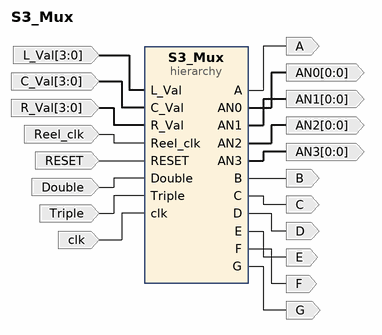
[diagram p0: block diagram of the top level]
# Vivado block design S3_Mux, xc7a35tcpg236-1, Vivado 2018.3
create_bd_design S3_Mux

create_bd_port -dir I -from 3 -to 0 L_Val
create_bd_port -dir I -from 3 -to 0 C_Val
create_bd_port -dir I -from 3 -to 0 R_Val
create_bd_port -dir I Triple
create_bd_port -dir I Double
create_bd_port -dir I Reel_clk
create_bd_port -dir O -from 0 -to 0 AN0
create_bd_port -dir O -from 0 -to 0 AN1
create_bd_port -dir O -from 0 -to 0 AN2
create_bd_port -dir O -from 0 -to 0 AN3
create_bd_port -dir O A
create_bd_port -dir O B
create_bd_port -dir O C
create_bd_port -dir O D
create_bd_port -dir O E
create_bd_port -dir O F
create_bd_port -dir O G
create_bd_port -dir I RESET
create_bd_port -dir I clk

create_bd_cell -type hier S3_Mux

# ---- hierarchy /S3_Mux ----
current_bd_instance /S3_Mux
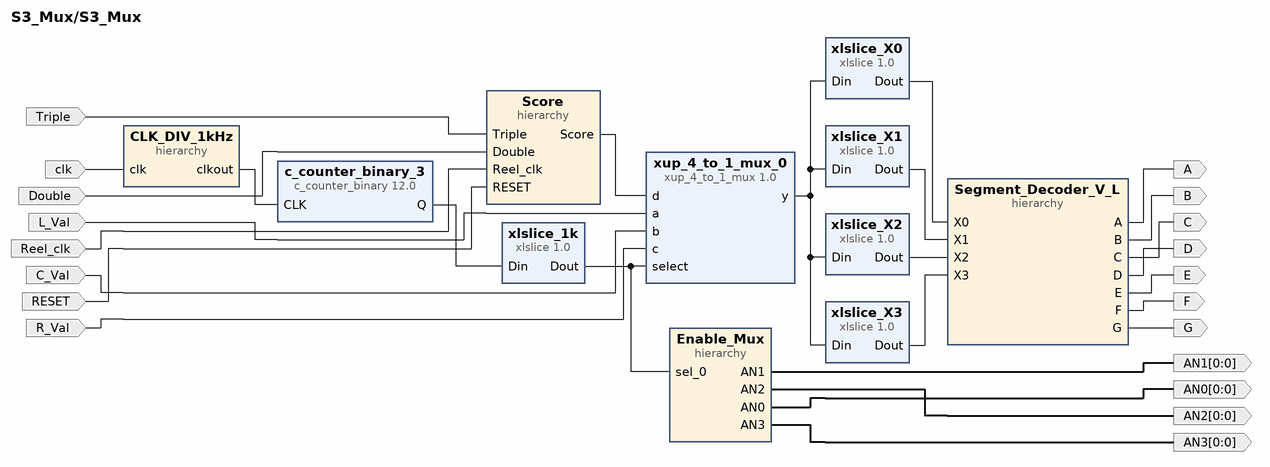
[diagram p1: block diagram inside /S3_Mux]
create_bd_pin -dir I L_Val
create_bd_pin -dir I C_Val
create_bd_pin -dir I R_Val
create_bd_pin -dir I Triple
create_bd_pin -dir I Double
create_bd_pin -dir I Reel_clk
create_bd_pin -dir I RESET
create_bd_pin -dir O -from 0 -to 0 AN1
create_bd_pin -dir O -from 0 -to 0 AN2
create_bd_pin -dir O -from 0 -to 0 AN3
create_bd_pin -dir O -from 0 -to 0 AN0
create_bd_pin -dir I clk
create_bd_pin -dir O G
create_bd_pin -dir O B
create_bd_pin -dir O A
create_bd_pin -dir O D
create_bd_pin -dir O F
create_bd_pin -dir O E
create_bd_pin -dir O C

create_bd_cell -type ip -vlnv xilinx.com:xup:xup_4_to_1_mux:1.0 xup_4_to_1_mux_0
create_bd_cell -type ip -vlnv xilinx.com:ip:xlslice:1.0 xlslice_X0
set_property -dict {CONFIG.DIN_FROM 0 CONFIG.DIN_TO 0 CONFIG.DIN_WIDTH 4} [get_bd_cells xlslice_X0]
create_bd_cell -type ip -vlnv xilinx.com:ip:xlslice:1.0 xlslice_X1
set_property -dict {CONFIG.DIN_FROM 0 CONFIG.DIN_TO 0 CONFIG.DIN_WIDTH 4} [get_bd_cells xlslice_X1]
create_bd_cell -type ip -vlnv xilinx.com:ip:xlslice:1.0 xlslice_1k
set_property -dict {CONFIG.DIN_FROM 1 CONFIG.DIN_TO 0 CONFIG.DIN_WIDTH 3 CONFIG.DOUT_WIDTH 2} [get_bd_cells xlslice_1k]
create_bd_cell -type ip -vlnv xilinx.com:ip:xlslice:1.0 xlslice_X2
set_property -dict {CONFIG.DIN_FROM 0 CONFIG.DIN_TO 0 CONFIG.DIN_WIDTH 4} [get_bd_cells xlslice_X2]
create_bd_cell -type ip -vlnv xilinx.com:ip:c_counter_binary:12.0 c_counter_binary_3
set_property -dict {CONFIG.Final_Count_Value 3 CONFIG.Output_Width 3 CONFIG.Restrict_Count true} [get_bd_cells c_counter_binary_3]
create_bd_cell -type ip -vlnv xilinx.com:ip:xlslice:1.0 xlslice_X3
set_property -dict {CONFIG.DIN_FROM 0 CONFIG.DIN_TO 0 CONFIG.DIN_WIDTH 4} [get_bd_cells xlslice_X3]
create_bd_cell -type hier Score
create_bd_cell -type hier Enable_Mux
create_bd_cell -type hier CLK_DIV_1kHz
create_bd_cell -type hier Segment_Decoder_V_L

# ---- hierarchy /S3_Mux/Score ----
current_bd_instance /S3_Mux/Score
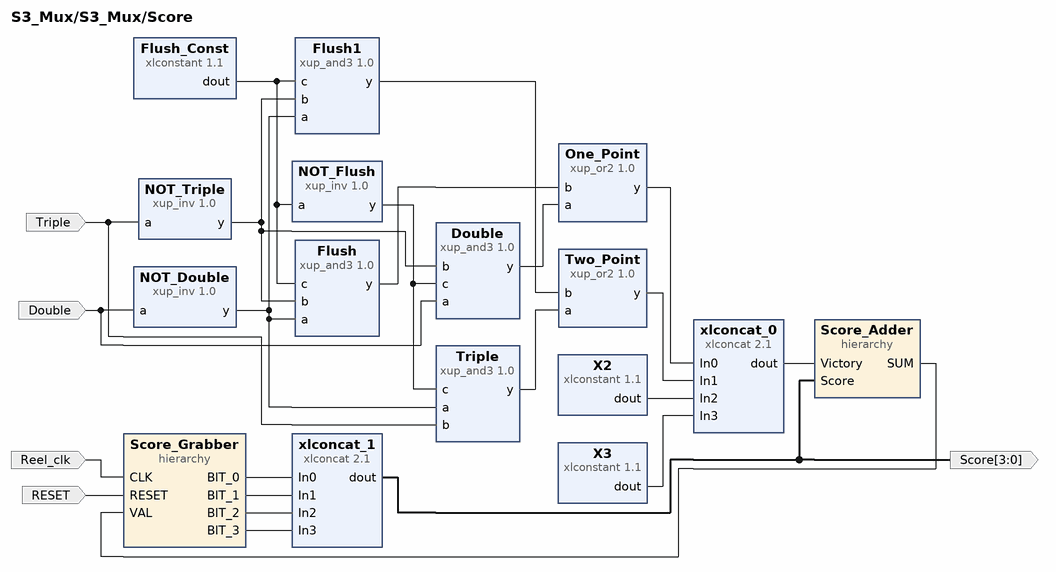
[diagram p2: block diagram inside /S3_Mux/Score]
create_bd_pin -dir I Triple
create_bd_pin -dir I Double
create_bd_pin -dir O -from 3 -to 0 Score
create_bd_pin -dir I Reel_clk
create_bd_pin -dir I RESET

create_bd_cell -type ip -vlnv xilinx.com:xup:xup_inv:1.0 NOT_Triple
set_property -dict {CONFIG.DELAY 0} [get_bd_cells NOT_Triple]
create_bd_cell -type ip -vlnv xilinx.com:xup:xup_or2:1.0 Two_Point
set_property -dict {CONFIG.DELAY 0} [get_bd_cells Two_Point]
create_bd_cell -type ip -vlnv xilinx.com:ip:xlconstant:1.1 Flush_Const
set_property -dict {CONFIG.CONST_VAL 0} [get_bd_cells Flush_Const]
create_bd_cell -type ip -vlnv xilinx.com:xup:xup_inv:1.0 NOT_Double
set_property -dict {CONFIG.DELAY 0} [get_bd_cells NOT_Double]
create_bd_cell -type ip -vlnv xilinx.com:ip:xlconcat:2.1 xlconcat_0
set_property -dict {CONFIG.NUM_PORTS 4} [get_bd_cells xlconcat_0]
create_bd_cell -type ip -vlnv xilinx.com:ip:xlconcat:2.1 xlconcat_1
set_property -dict {CONFIG.NUM_PORTS 4} [get_bd_cells xlconcat_1]
create_bd_cell -type ip -vlnv xilinx.com:xup:xup_and3:1.0 Flush
create_bd_cell -type ip -vlnv xilinx.com:xup:xup_and3:1.0 Double
create_bd_cell -type ip -vlnv xilinx.com:xup:xup_inv:1.0 NOT_Flush
set_property -dict {CONFIG.DELAY 0} [get_bd_cells NOT_Flush]
create_bd_cell -type ip -vlnv xilinx.com:xup:xup_and3:1.0 Triple
create_bd_cell -type ip -vlnv xilinx.com:xup:xup_and3:1.0 Flush1
create_bd_cell -type ip -vlnv xilinx.com:ip:xlconstant:1.1 X2
set_property -dict {CONFIG.CONST_VAL 0} [get_bd_cells X2]
create_bd_cell -type ip -vlnv xilinx.com:ip:xlconstant:1.1 X3
set_property -dict {CONFIG.CONST_VAL 0} [get_bd_cells X3]
create_bd_cell -type ip -vlnv xilinx.com:xup:xup_or2:1.0 One_Point
set_property -dict {CONFIG.DELAY 0} [get_bd_cells One_Point]
create_bd_cell -type hier Score_Adder
create_bd_cell -type hier Score_Grabber

# ---- hierarchy /S3_Mux/Score/Score_Adder ----
current_bd_instance /S3_Mux/Score/Score_Adder
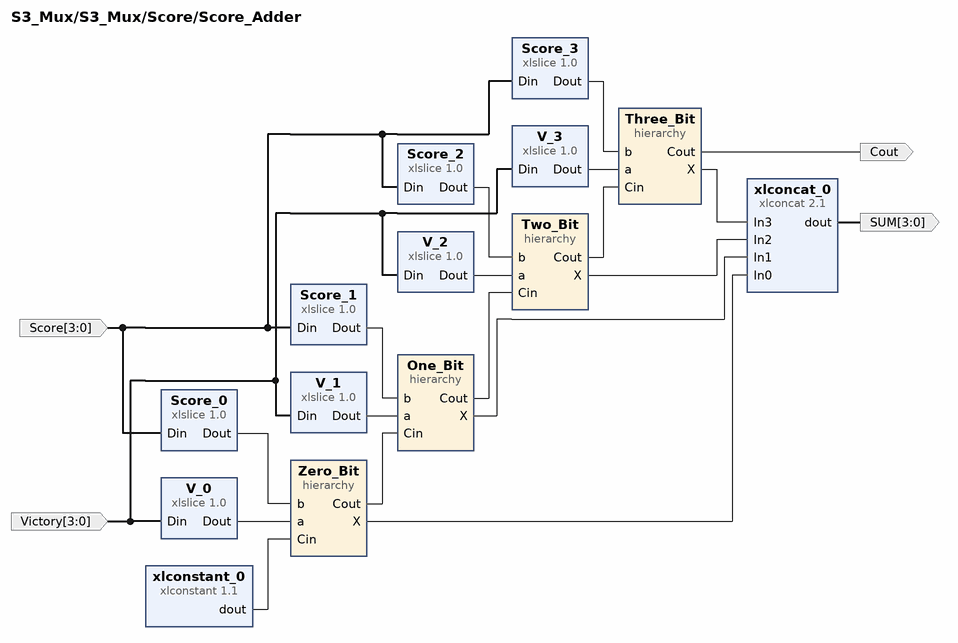
[diagram p3: block diagram inside /S3_Mux/Score/Score_Adder]
create_bd_pin -dir I -from 3 -to 0 Score
create_bd_pin -dir O -from 3 -to 0 SUM
create_bd_pin -dir I -from 3 -to 0 Victory
create_bd_pin -dir O Cout

create_bd_cell -type ip -vlnv xilinx.com:ip:xlslice:1.0 Score_0
set_property -dict {CONFIG.DIN_FROM 0 CONFIG.DIN_TO 0 CONFIG.DIN_WIDTH 4} [get_bd_cells Score_0]
create_bd_cell -type ip -vlnv xilinx.com:ip:xlslice:1.0 Score_1
set_property -dict {CONFIG.DIN_FROM 1 CONFIG.DIN_TO 1 CONFIG.DIN_WIDTH 4 CONFIG.DOUT_WIDTH 1} [get_bd_cells Score_1]
create_bd_cell -type ip -vlnv xilinx.com:ip:xlconcat:2.1 xlconcat_0
set_property -dict {CONFIG.NUM_PORTS 4} [get_bd_cells xlconcat_0]
create_bd_cell -type ip -vlnv xilinx.com:ip:xlslice:1.0 Score_2
set_property -dict {CONFIG.DIN_FROM 2 CONFIG.DIN_TO 2 CONFIG.DIN_WIDTH 4 CONFIG.DOUT_WIDTH 1} [get_bd_cells Score_2]
create_bd_cell -type ip -vlnv xilinx.com:ip:xlconstant:1.1 xlconstant_0
set_property -dict {CONFIG.CONST_VAL 0} [get_bd_cells xlconstant_0]
create_bd_cell -type ip -vlnv xilinx.com:ip:xlslice:1.0 Score_3
set_property -dict {CONFIG.DIN_FROM 3 CONFIG.DIN_TO 3 CONFIG.DIN_WIDTH 4 CONFIG.DOUT_WIDTH 1} [get_bd_cells Score_3]
create_bd_cell -type ip -vlnv xilinx.com:ip:xlslice:1.0 V_0
set_property -dict {CONFIG.DIN_FROM 0 CONFIG.DIN_TO 0 CONFIG.DIN_WIDTH 4} [get_bd_cells V_0]
create_bd_cell -type ip -vlnv xilinx.com:ip:xlslice:1.0 V_1
set_property -dict {CONFIG.DIN_FROM 1 CONFIG.DIN_TO 1 CONFIG.DIN_WIDTH 4 CONFIG.DOUT_WIDTH 1} [get_bd_cells V_1]
create_bd_cell -type ip -vlnv xilinx.com:ip:xlslice:1.0 V_2
set_property -dict {CONFIG.DIN_FROM 2 CONFIG.DIN_TO 2 CONFIG.DIN_WIDTH 4 CONFIG.DOUT_WIDTH 1} [get_bd_cells V_2]
create_bd_cell -type ip -vlnv xilinx.com:ip:xlslice:1.0 V_3
set_property -dict {CONFIG.DIN_FROM 3 CONFIG.DIN_TO 3 CONFIG.DIN_WIDTH 4 CONFIG.DOUT_WIDTH 1} [get_bd_cells V_3]
create_bd_cell -type hier One_Bit
create_bd_cell -type hier Three_Bit
create_bd_cell -type hier Zero_Bit
create_bd_cell -type hier Two_Bit

# ---- hierarchy /S3_Mux/Score/Score_Adder/One_Bit ----
current_bd_instance /S3_Mux/Score/Score_Adder/One_Bit
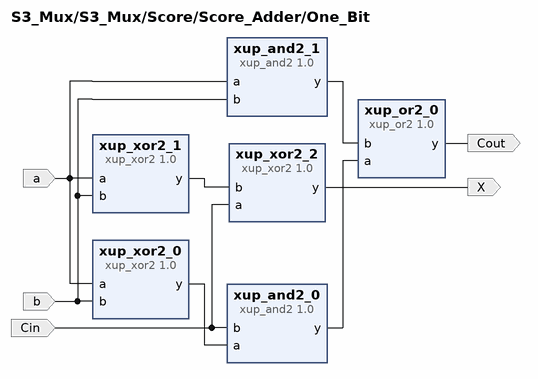
[diagram p4: block diagram inside /S3_Mux/Score/Score_Adder/One_Bit]
create_bd_pin -dir I a
create_bd_pin -dir I b
create_bd_pin -dir I Cin
create_bd_pin -dir O X
create_bd_pin -dir O Cout

create_bd_cell -type ip -vlnv xilinx.com:xup:xup_xor2:1.0 xup_xor2_0
set_property -dict {CONFIG.DELAY 0} [get_bd_cells xup_xor2_0]
create_bd_cell -type ip -vlnv xilinx.com:xup:xup_xor2:1.0 xup_xor2_1
set_property -dict {CONFIG.DELAY 0} [get_bd_cells xup_xor2_1]
create_bd_cell -type ip -vlnv xilinx.com:xup:xup_xor2:1.0 xup_xor2_2
set_property -dict {CONFIG.DELAY 0} [get_bd_cells xup_xor2_2]
create_bd_cell -type ip -vlnv xilinx.com:xup:xup_and2:1.0 xup_and2_0
create_bd_cell -type ip -vlnv xilinx.com:xup:xup_and2:1.0 xup_and2_1
create_bd_cell -type ip -vlnv xilinx.com:xup:xup_or2:1.0 xup_or2_0
set_property -dict {CONFIG.DELAY 0} [get_bd_cells xup_or2_0]

# ---- hierarchy /S3_Mux/Score/Score_Adder/Three_Bit ----
current_bd_instance /S3_Mux/Score/Score_Adder/Three_Bit
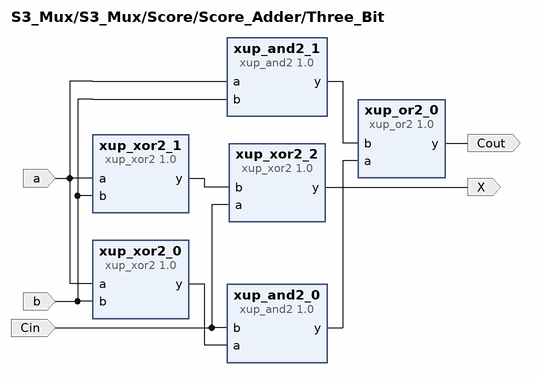
[diagram p5: block diagram inside /S3_Mux/Score/Score_Adder/Three_Bit]
create_bd_pin -dir I a
create_bd_pin -dir I b
create_bd_pin -dir I Cin
create_bd_pin -dir O X
create_bd_pin -dir O Cout

create_bd_cell -type ip -vlnv xilinx.com:xup:xup_xor2:1.0 xup_xor2_0
set_property -dict {CONFIG.DELAY 0} [get_bd_cells xup_xor2_0]
create_bd_cell -type ip -vlnv xilinx.com:xup:xup_xor2:1.0 xup_xor2_1
set_property -dict {CONFIG.DELAY 0} [get_bd_cells xup_xor2_1]
create_bd_cell -type ip -vlnv xilinx.com:xup:xup_xor2:1.0 xup_xor2_2
set_property -dict {CONFIG.DELAY 0} [get_bd_cells xup_xor2_2]
create_bd_cell -type ip -vlnv xilinx.com:xup:xup_and2:1.0 xup_and2_0
create_bd_cell -type ip -vlnv xilinx.com:xup:xup_and2:1.0 xup_and2_1
create_bd_cell -type ip -vlnv xilinx.com:xup:xup_or2:1.0 xup_or2_0
set_property -dict {CONFIG.DELAY 0} [get_bd_cells xup_or2_0]

# ---- hierarchy /S3_Mux/Score/Score_Adder/Zero_Bit ----
current_bd_instance /S3_Mux/Score/Score_Adder/Zero_Bit
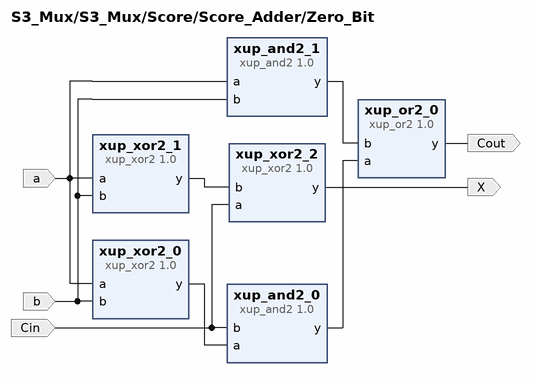
[diagram p6: block diagram inside /S3_Mux/Score/Score_Adder/Zero_Bit]
create_bd_pin -dir I a
create_bd_pin -dir I b
create_bd_pin -dir I Cin
create_bd_pin -dir O X
create_bd_pin -dir O Cout

create_bd_cell -type ip -vlnv xilinx.com:xup:xup_xor2:1.0 xup_xor2_0
set_property -dict {CONFIG.DELAY 0} [get_bd_cells xup_xor2_0]
create_bd_cell -type ip -vlnv xilinx.com:xup:xup_xor2:1.0 xup_xor2_1
set_property -dict {CONFIG.DELAY 0} [get_bd_cells xup_xor2_1]
create_bd_cell -type ip -vlnv xilinx.com:xup:xup_xor2:1.0 xup_xor2_2
set_property -dict {CONFIG.DELAY 0} [get_bd_cells xup_xor2_2]
create_bd_cell -type ip -vlnv xilinx.com:xup:xup_and2:1.0 xup_and2_0
create_bd_cell -type ip -vlnv xilinx.com:xup:xup_and2:1.0 xup_and2_1
create_bd_cell -type ip -vlnv xilinx.com:xup:xup_or2:1.0 xup_or2_0
set_property -dict {CONFIG.DELAY 0} [get_bd_cells xup_or2_0]

# ---- hierarchy /S3_Mux/Score/Score_Adder/Two_Bit ----
current_bd_instance /S3_Mux/Score/Score_Adder/Two_Bit
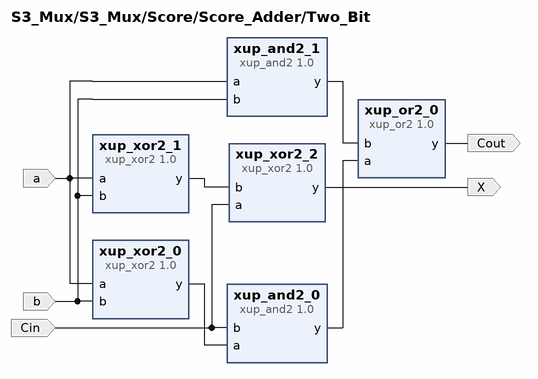
[diagram p7: block diagram inside /S3_Mux/Score/Score_Adder/Two_Bit]
create_bd_pin -dir I a
create_bd_pin -dir I b
create_bd_pin -dir I Cin
create_bd_pin -dir O X
create_bd_pin -dir O Cout

create_bd_cell -type ip -vlnv xilinx.com:xup:xup_xor2:1.0 xup_xor2_0
set_property -dict {CONFIG.DELAY 0} [get_bd_cells xup_xor2_0]
create_bd_cell -type ip -vlnv xilinx.com:xup:xup_xor2:1.0 xup_xor2_1
set_property -dict {CONFIG.DELAY 0} [get_bd_cells xup_xor2_1]
create_bd_cell -type ip -vlnv xilinx.com:xup:xup_xor2:1.0 xup_xor2_2
set_property -dict {CONFIG.DELAY 0} [get_bd_cells xup_xor2_2]
create_bd_cell -type ip -vlnv xilinx.com:xup:xup_and2:1.0 xup_and2_0
create_bd_cell -type ip -vlnv xilinx.com:xup:xup_and2:1.0 xup_and2_1
create_bd_cell -type ip -vlnv xilinx.com:xup:xup_or2:1.0 xup_or2_0
set_property -dict {CONFIG.DELAY 0} [get_bd_cells xup_or2_0]

# ---- hierarchy /S3_Mux/Score/Score_Grabber ----
current_bd_instance /S3_Mux/Score/Score_Grabber
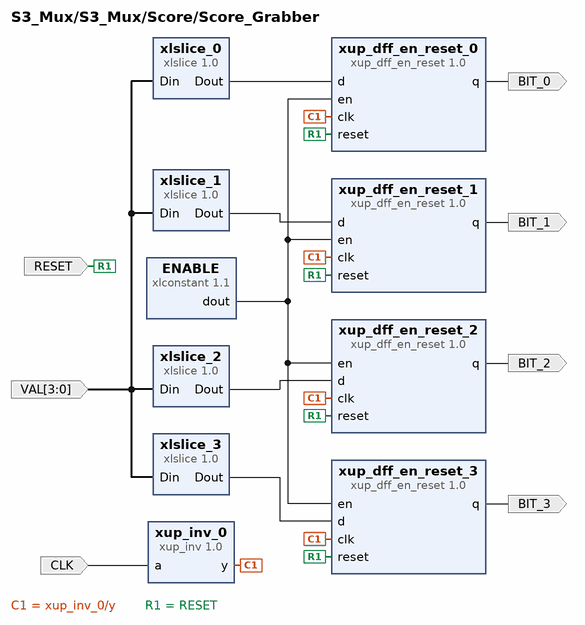
[diagram p8: block diagram inside /S3_Mux/Score/Score_Grabber]
create_bd_pin -dir I CLK
create_bd_pin -dir I RESET
create_bd_pin -dir O BIT_0
create_bd_pin -dir I -from 3 -to 0 VAL
create_bd_pin -dir O BIT_1
create_bd_pin -dir O BIT_2
create_bd_pin -dir O BIT_3

create_bd_cell -type ip -vlnv xilinx.com:xup:xup_dff_en_reset:1.0 xup_dff_en_reset_0
set_property -dict {CONFIG.DELAY 0} [get_bd_cells xup_dff_en_reset_0]
create_bd_cell -type ip -vlnv xilinx.com:ip:xlslice:1.0 xlslice_0
set_property -dict {CONFIG.DIN_FROM 0 CONFIG.DIN_TO 0 CONFIG.DIN_WIDTH 4} [get_bd_cells xlslice_0]
create_bd_cell -type ip -vlnv xilinx.com:xup:xup_dff_en_reset:1.0 xup_dff_en_reset_1
set_property -dict {CONFIG.DELAY 0} [get_bd_cells xup_dff_en_reset_1]
create_bd_cell -type ip -vlnv xilinx.com:ip:xlslice:1.0 xlslice_1
set_property -dict {CONFIG.DIN_FROM 1 CONFIG.DIN_TO 1 CONFIG.DIN_WIDTH 4 CONFIG.DOUT_WIDTH 1} [get_bd_cells xlslice_1]
create_bd_cell -type ip -vlnv xilinx.com:xup:xup_dff_en_reset:1.0 xup_dff_en_reset_2
set_property -dict {CONFIG.DELAY 0} [get_bd_cells xup_dff_en_reset_2]
create_bd_cell -type ip -vlnv xilinx.com:ip:xlslice:1.0 xlslice_2
set_property -dict {CONFIG.DIN_FROM 2 CONFIG.DIN_TO 2 CONFIG.DIN_WIDTH 4 CONFIG.DOUT_WIDTH 1} [get_bd_cells xlslice_2]
create_bd_cell -type ip -vlnv xilinx.com:xup:xup_dff_en_reset:1.0 xup_dff_en_reset_3
set_property -dict {CONFIG.DELAY 0} [get_bd_cells xup_dff_en_reset_3]
create_bd_cell -type ip -vlnv xilinx.com:ip:xlslice:1.0 xlslice_3
set_property -dict {CONFIG.DIN_FROM 3 CONFIG.DIN_TO 3 CONFIG.DIN_WIDTH 4 CONFIG.DOUT_WIDTH 1} [get_bd_cells xlslice_3]
create_bd_cell -type ip -vlnv xilinx.com:xup:xup_inv:1.0 xup_inv_0
set_property -dict {CONFIG.DELAY 0} [get_bd_cells xup_inv_0]
create_bd_cell -type ip -vlnv xilinx.com:ip:xlconstant:1.1 ENABLE
set_property -dict {CONFIG.CONST_VAL 0} [get_bd_cells ENABLE]

# ---- hierarchy /S3_Mux/Enable_Mux ----
current_bd_instance /S3_Mux/Enable_Mux
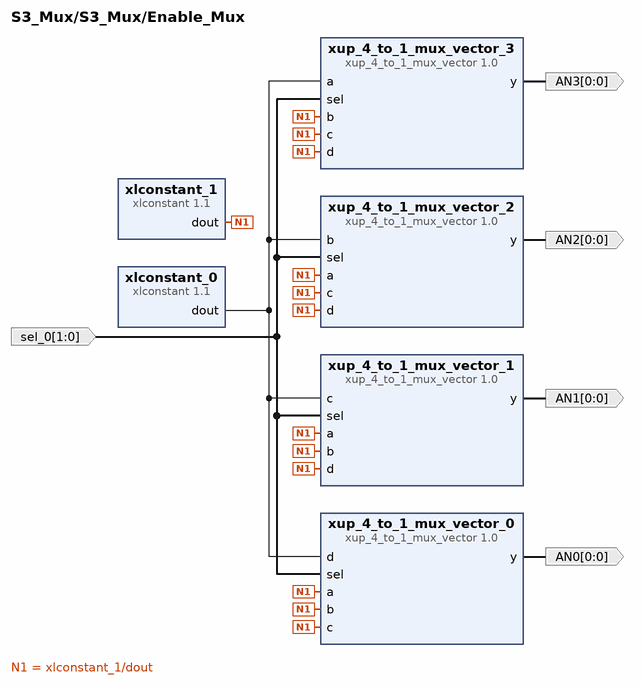
[diagram p9: block diagram inside /S3_Mux/Enable_Mux]
create_bd_pin -dir I -from 1 -to 0 sel_0
create_bd_pin -dir O -from 0 -to 0 AN1
create_bd_pin -dir O -from 0 -to 0 AN2
create_bd_pin -dir O -from 0 -to 0 AN3
create_bd_pin -dir O -from 0 -to 0 AN0

create_bd_cell -type ip -vlnv xilinx.com:xup:xup_4_to_1_mux_vector:1.0 xup_4_to_1_mux_vector_1
set_property -dict {CONFIG.DELAY 0 CONFIG.SIZE 1} [get_bd_cells xup_4_to_1_mux_vector_1]
create_bd_cell -type ip -vlnv xilinx.com:xup:xup_4_to_1_mux_vector:1.0 xup_4_to_1_mux_vector_2
set_property -dict {CONFIG.DELAY 0 CONFIG.SIZE 1} [get_bd_cells xup_4_to_1_mux_vector_2]
create_bd_cell -type ip -vlnv xilinx.com:xup:xup_4_to_1_mux_vector:1.0 xup_4_to_1_mux_vector_3
set_property -dict {CONFIG.DELAY 0 CONFIG.SIZE 1} [get_bd_cells xup_4_to_1_mux_vector_3]
create_bd_cell -type ip -vlnv xilinx.com:ip:xlconstant:1.1 xlconstant_0
set_property -dict {CONFIG.CONST_VAL 0} [get_bd_cells xlconstant_0]
create_bd_cell -type ip -vlnv xilinx.com:ip:xlconstant:1.1 xlconstant_1
create_bd_cell -type ip -vlnv xilinx.com:xup:xup_4_to_1_mux_vector:1.0 xup_4_to_1_mux_vector_0
set_property -dict {CONFIG.DELAY 0 CONFIG.SIZE 1} [get_bd_cells xup_4_to_1_mux_vector_0]

# ---- hierarchy /S3_Mux/CLK_DIV_1kHz ----
current_bd_instance /S3_Mux/CLK_DIV_1kHz
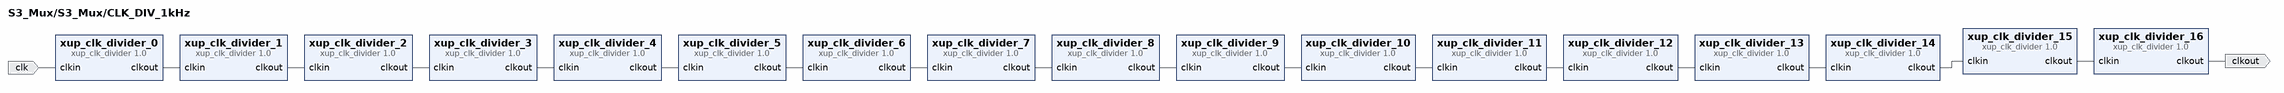
[diagram p10: block diagram inside /S3_Mux/CLK_DIV_1kHz]
create_bd_pin -dir O clkout
create_bd_pin -dir I clk

create_bd_cell -type ip -vlnv xilinx.com:xup:xup_clk_divider:1.0 xup_clk_divider_15
create_bd_cell -type ip -vlnv xilinx.com:xup:xup_clk_divider:1.0 xup_clk_divider_2
create_bd_cell -type ip -vlnv xilinx.com:xup:xup_clk_divider:1.0 xup_clk_divider_16
create_bd_cell -type ip -vlnv xilinx.com:xup:xup_clk_divider:1.0 xup_clk_divider_3
create_bd_cell -type ip -vlnv xilinx.com:xup:xup_clk_divider:1.0 xup_clk_divider_4
create_bd_cell -type ip -vlnv xilinx.com:xup:xup_clk_divider:1.0 xup_clk_divider_5
create_bd_cell -type ip -vlnv xilinx.com:xup:xup_clk_divider:1.0 xup_clk_divider_6
create_bd_cell -type ip -vlnv xilinx.com:xup:xup_clk_divider:1.0 xup_clk_divider_7
create_bd_cell -type ip -vlnv xilinx.com:xup:xup_clk_divider:1.0 xup_clk_divider_8
create_bd_cell -type ip -vlnv xilinx.com:xup:xup_clk_divider:1.0 xup_clk_divider_9
create_bd_cell -type ip -vlnv xilinx.com:xup:xup_clk_divider:1.0 xup_clk_divider_10
create_bd_cell -type ip -vlnv xilinx.com:xup:xup_clk_divider:1.0 xup_clk_divider_11
create_bd_cell -type ip -vlnv xilinx.com:xup:xup_clk_divider:1.0 xup_clk_divider_12
create_bd_cell -type ip -vlnv xilinx.com:xup:xup_clk_divider:1.0 xup_clk_divider_13
create_bd_cell -type ip -vlnv xilinx.com:xup:xup_clk_divider:1.0 xup_clk_divider_0
create_bd_cell -type ip -vlnv xilinx.com:xup:xup_clk_divider:1.0 xup_clk_divider_14
create_bd_cell -type ip -vlnv xilinx.com:xup:xup_clk_divider:1.0 xup_clk_divider_1

# ---- hierarchy /S3_Mux/Segment_Decoder_V_L ----
current_bd_instance /S3_Mux/Segment_Decoder_V_L
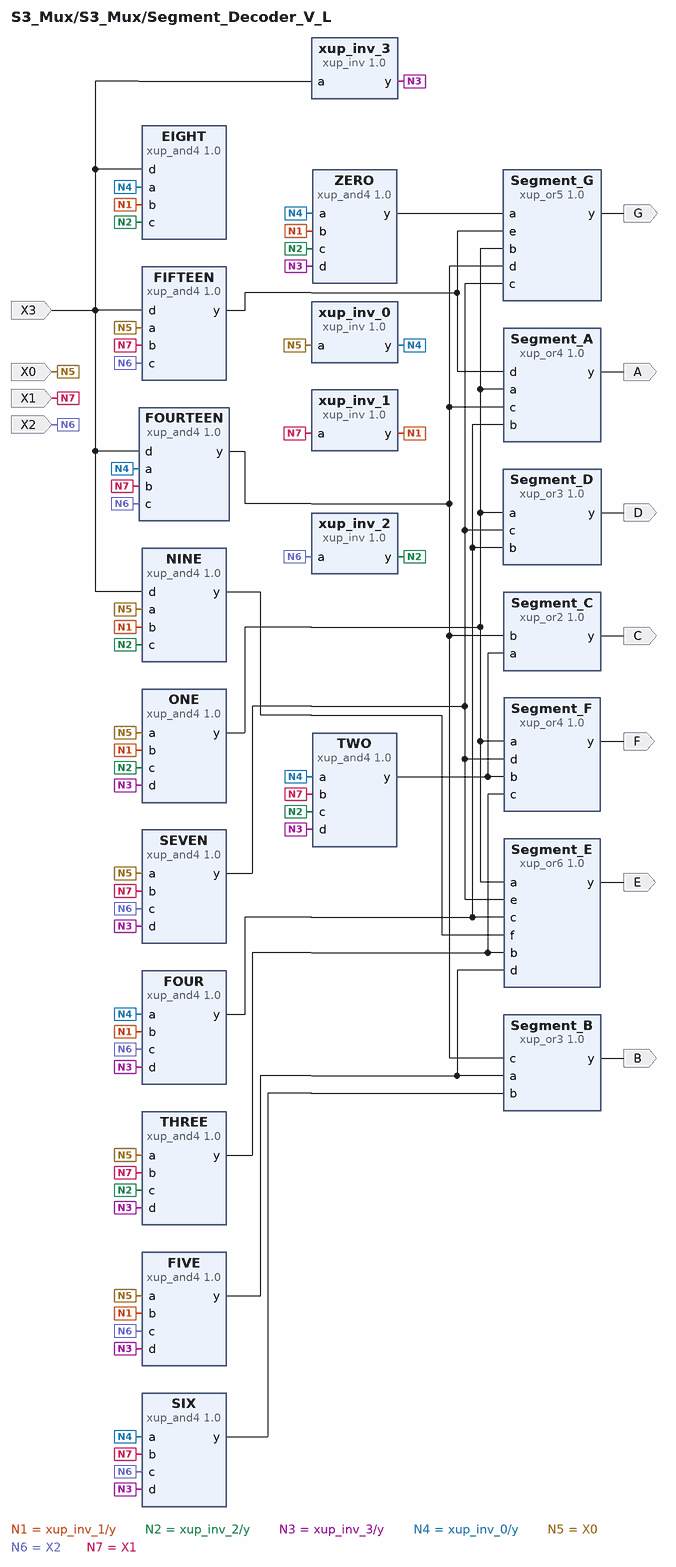
[diagram p11: block diagram inside /S3_Mux/Segment_Decoder_V_L]
create_bd_pin -dir I X0
create_bd_pin -dir O G
create_bd_pin -dir I X2
create_bd_pin -dir I X1
create_bd_pin -dir I X3
create_bd_pin -dir O B
create_bd_pin -dir O A
create_bd_pin -dir O D
create_bd_pin -dir O F
create_bd_pin -dir O E
create_bd_pin -dir O C

create_bd_cell -type ip -vlnv xilinx.com:xup:xup_and4:1.0 ONE
set_property -dict {CONFIG.DELAY 0} [get_bd_cells ONE]
create_bd_cell -type ip -vlnv xilinx.com:xup:xup_or5:1.0 Segment_G
set_property -dict {CONFIG.DELAY 0} [get_bd_cells Segment_G]
create_bd_cell -type ip -vlnv xilinx.com:xup:xup_and4:1.0 FOUR
set_property -dict {CONFIG.DELAY 0} [get_bd_cells FOUR]
create_bd_cell -type ip -vlnv xilinx.com:xup:xup_and4:1.0 FOURTEEN
set_property -dict {CONFIG.DELAY 0} [get_bd_cells FOURTEEN]
create_bd_cell -type ip -vlnv xilinx.com:xup:xup_and4:1.0 TWO
set_property -dict {CONFIG.DELAY 0} [get_bd_cells TWO]
create_bd_cell -type ip -vlnv xilinx.com:xup:xup_and4:1.0 FIVE
set_property -dict {CONFIG.DELAY 0} [get_bd_cells FIVE]
create_bd_cell -type ip -vlnv xilinx.com:xup:xup_or3:1.0 Segment_B
set_property -dict {CONFIG.DELAY 0} [get_bd_cells Segment_B]
create_bd_cell -type ip -vlnv xilinx.com:xup:xup_and4:1.0 SEVEN
set_property -dict {CONFIG.DELAY 0} [get_bd_cells SEVEN]
create_bd_cell -type ip -vlnv xilinx.com:xup:xup_or4:1.0 Segment_A
set_property -dict {CONFIG.DELAY 0} [get_bd_cells Segment_A]
create_bd_cell -type ip -vlnv xilinx.com:xup:xup_or3:1.0 Segment_D
set_property -dict {CONFIG.DELAY 0} [get_bd_cells Segment_D]
create_bd_cell -type ip -vlnv xilinx.com:xup:xup_and4:1.0 EIGHT
set_property -dict {CONFIG.DELAY 0} [get_bd_cells EIGHT]
create_bd_cell -type ip -vlnv xilinx.com:xup:xup_or4:1.0 Segment_F
set_property -dict {CONFIG.DELAY 0} [get_bd_cells Segment_F]
create_bd_cell -type ip -vlnv xilinx.com:xup:xup_or6:1.0 Segment_E
set_property -dict {CONFIG.DELAY 0} [get_bd_cells Segment_E]
create_bd_cell -type ip -vlnv xilinx.com:xup:xup_inv:1.0 xup_inv_0
set_property -dict {CONFIG.DELAY 0} [get_bd_cells xup_inv_0]
create_bd_cell -type ip -vlnv xilinx.com:xup:xup_and4:1.0 FIFTEEN
set_property -dict {CONFIG.DELAY 0} [get_bd_cells FIFTEEN]
create_bd_cell -type ip -vlnv xilinx.com:xup:xup_inv:1.0 xup_inv_1
set_property -dict {CONFIG.DELAY 0} [get_bd_cells xup_inv_1]
create_bd_cell -type ip -vlnv xilinx.com:xup:xup_and4:1.0 NINE
set_property -dict {CONFIG.DELAY 0} [get_bd_cells NINE]
create_bd_cell -type ip -vlnv xilinx.com:xup:xup_inv:1.0 xup_inv_2
set_property -dict {CONFIG.DELAY 0} [get_bd_cells xup_inv_2]
create_bd_cell -type ip -vlnv xilinx.com:xup:xup_and4:1.0 THREE
set_property -dict {CONFIG.DELAY 0} [get_bd_cells THREE]
create_bd_cell -type ip -vlnv xilinx.com:xup:xup_and4:1.0 SIX
set_property -dict {CONFIG.DELAY 0} [get_bd_cells SIX]
create_bd_cell -type ip -vlnv xilinx.com:xup:xup_inv:1.0 xup_inv_3
set_property -dict {CONFIG.DELAY 0} [get_bd_cells xup_inv_3]
create_bd_cell -type ip -vlnv xilinx.com:xup:xup_and4:1.0 ZERO
set_property -dict {CONFIG.DELAY 0} [get_bd_cells ZERO]
create_bd_cell -type ip -vlnv xilinx.com:xup:xup_or2:1.0 Segment_C
set_property -dict {CONFIG.DELAY 0} [get_bd_cells Segment_C]

# ---- connections ----

current_bd_instance /S3_Mux
connect_bd_net [get_bd_pins Score/Score] [get_bd_pins xup_4_to_1_mux_0/d]
connect_bd_net -net xlslice_800_Dout [get_bd_pins xlslice_1k/Dout] [get_bd_pins xup_4_to_1_mux_0/select] [get_bd_pins Enable_Mux/sel_0]
connect_bd_net [get_bd_pins xup_4_to_1_mux_0/y] \
  [get_bd_pins xlslice_X0/Din] [get_bd_pins xlslice_X1/Din] [get_bd_pins xlslice_X2/Din] [get_bd_pins xlslice_X3/Din]
connect_bd_net [get_bd_pins xlslice_X0/Dout] [get_bd_pins Segment_Decoder_V_L/X0]
connect_bd_net [get_bd_pins xlslice_X1/Dout] [get_bd_pins Segment_Decoder_V_L/X1]
connect_bd_net [get_bd_pins c_counter_binary_3/Q] [get_bd_pins xlslice_1k/Din]
connect_bd_net [get_bd_pins xlslice_X2/Dout] [get_bd_pins Segment_Decoder_V_L/X2]
connect_bd_net -net CLK_DIV_800Hz_clkout [get_bd_pins CLK_DIV_1kHz/clkout] [get_bd_pins c_counter_binary_3/CLK]
connect_bd_net [get_bd_pins xlslice_X3/Dout] [get_bd_pins Segment_Decoder_V_L/X3]
connect_bd_net [get_bd_pins L_Val] [get_bd_pins xup_4_to_1_mux_0/a]
connect_bd_net [get_bd_pins C_Val] [get_bd_pins xup_4_to_1_mux_0/b]
connect_bd_net [get_bd_pins R_Val] [get_bd_pins xup_4_to_1_mux_0/c]
connect_bd_net [get_bd_pins Triple] [get_bd_pins Score/Triple]
connect_bd_net [get_bd_pins Double] [get_bd_pins Score/Double]
connect_bd_net [get_bd_pins Reel_clk] [get_bd_pins Score/Reel_clk]
connect_bd_net [get_bd_pins RESET] [get_bd_pins Score/RESET]
connect_bd_net [get_bd_pins Enable_Mux/AN1] [get_bd_pins AN1]
connect_bd_net [get_bd_pins Enable_Mux/AN2] [get_bd_pins AN2]
connect_bd_net [get_bd_pins Enable_Mux/AN3] [get_bd_pins AN3]
connect_bd_net [get_bd_pins Enable_Mux/AN0] [get_bd_pins AN0]
connect_bd_net [get_bd_pins clk] [get_bd_pins CLK_DIV_1kHz/clk]
connect_bd_net [get_bd_pins Segment_Decoder_V_L/G] [get_bd_pins G]
connect_bd_net [get_bd_pins Segment_Decoder_V_L/B] [get_bd_pins B]
connect_bd_net [get_bd_pins Segment_Decoder_V_L/A] [get_bd_pins A]
connect_bd_net [get_bd_pins Segment_Decoder_V_L/D] [get_bd_pins D]
connect_bd_net [get_bd_pins Segment_Decoder_V_L/F] [get_bd_pins F]
connect_bd_net [get_bd_pins Segment_Decoder_V_L/E] [get_bd_pins E]
connect_bd_net [get_bd_pins Segment_Decoder_V_L/C] [get_bd_pins C]

current_bd_instance /S3_Mux/Score
connect_bd_net [get_bd_pins NOT_Triple/y] [get_bd_pins Double/b] [get_bd_pins Flush/b] [get_bd_pins Flush1/b]
connect_bd_net [get_bd_pins Triple/y] [get_bd_pins Two_Point/a]
connect_bd_net [get_bd_pins Flush1/y] [get_bd_pins Two_Point/b]
connect_bd_net -net xup_or2_1_y [get_bd_pins Two_Point/y] [get_bd_pins xlconcat_0/In1]
connect_bd_net -net xlconstant_0_dout [get_bd_pins Flush_Const/dout] [get_bd_pins NOT_Flush/a] [get_bd_pins Flush/c] [get_bd_pins Flush1/c]
connect_bd_net [get_bd_pins NOT_Double/y] [get_bd_pins Flush/a] [get_bd_pins Flush1/a] [get_bd_pins Triple/a]
connect_bd_net -net xup_or2_0_y [get_bd_pins One_Point/y] [get_bd_pins xlconcat_0/In0]
connect_bd_net [get_bd_pins X2/dout] [get_bd_pins xlconcat_0/In2]
connect_bd_net [get_bd_pins X3/dout] [get_bd_pins xlconcat_0/In3]
connect_bd_net [get_bd_pins xlconcat_0/dout] [get_bd_pins Score_Adder/Victory]
connect_bd_net [get_bd_pins Score_Grabber/BIT_0] [get_bd_pins xlconcat_1/In0]
connect_bd_net [get_bd_pins Score_Grabber/BIT_1] [get_bd_pins xlconcat_1/In1]
connect_bd_net [get_bd_pins Score_Grabber/BIT_2] [get_bd_pins xlconcat_1/In2]
connect_bd_net [get_bd_pins Score_Grabber/BIT_3] [get_bd_pins xlconcat_1/In3]
connect_bd_net [get_bd_pins Flush/y] [get_bd_pins One_Point/b]
connect_bd_net [get_bd_pins NOT_Flush/y] [get_bd_pins Double/c] [get_bd_pins Triple/c]
connect_bd_net [get_bd_pins Double/y] [get_bd_pins One_Point/a]
connect_bd_net [get_bd_pins Score_Adder/SUM] [get_bd_pins Score_Grabber/VAL]
connect_bd_net [get_bd_pins Triple] [get_bd_pins Triple/b] [get_bd_pins NOT_Triple/a]
connect_bd_net [get_bd_pins Double] [get_bd_pins Double/a] [get_bd_pins NOT_Double/a]
connect_bd_net [get_bd_pins xlconcat_1/dout] [get_bd_pins Score] [get_bd_pins Score_Adder/Score]
connect_bd_net [get_bd_pins Reel_clk] [get_bd_pins Score_Grabber/CLK]
connect_bd_net [get_bd_pins RESET] [get_bd_pins Score_Grabber/RESET]

current_bd_instance /S3_Mux/Score/Score_Adder
connect_bd_net [get_bd_pins Score_0/Dout] [get_bd_pins Zero_Bit/b]
connect_bd_net [get_bd_pins Score_1/Dout] [get_bd_pins One_Bit/b]
connect_bd_net [get_bd_pins Zero_Bit/X] [get_bd_pins xlconcat_0/In0]
connect_bd_net [get_bd_pins One_Bit/X] [get_bd_pins xlconcat_0/In1]
connect_bd_net [get_bd_pins Two_Bit/X] [get_bd_pins xlconcat_0/In2]
connect_bd_net [get_bd_pins Three_Bit/X] [get_bd_pins xlconcat_0/In3]
connect_bd_net [get_bd_pins Score_2/Dout] [get_bd_pins Two_Bit/b]
connect_bd_net [get_bd_pins xlconstant_0/dout] [get_bd_pins Zero_Bit/Cin]
connect_bd_net [get_bd_pins Score_3/Dout] [get_bd_pins Three_Bit/b]
connect_bd_net [get_bd_pins V_0/Dout] [get_bd_pins Zero_Bit/a]
connect_bd_net [get_bd_pins V_1/Dout] [get_bd_pins One_Bit/a]
connect_bd_net [get_bd_pins V_2/Dout] [get_bd_pins Two_Bit/a]
connect_bd_net [get_bd_pins V_3/Dout] [get_bd_pins Three_Bit/a]
connect_bd_net [get_bd_pins Zero_Bit/Cout] [get_bd_pins One_Bit/Cin]
connect_bd_net [get_bd_pins One_Bit/Cout] [get_bd_pins Two_Bit/Cin]
connect_bd_net [get_bd_pins Two_Bit/Cout] [get_bd_pins Three_Bit/Cin]
connect_bd_net [get_bd_pins Score] [get_bd_pins Score_1/Din] [get_bd_pins Score_2/Din] [get_bd_pins Score_3/Din] [get_bd_pins Score_0/Din]
connect_bd_net [get_bd_pins xlconcat_0/dout] [get_bd_pins SUM]
connect_bd_net [get_bd_pins Victory] [get_bd_pins V_1/Din] [get_bd_pins V_2/Din] [get_bd_pins V_3/Din] [get_bd_pins V_0/Din]
connect_bd_net [get_bd_pins Three_Bit/Cout] [get_bd_pins Cout]

current_bd_instance /S3_Mux/Score/Score_Adder/One_Bit
connect_bd_net [get_bd_pins xup_xor2_0/y] [get_bd_pins xup_and2_0/a]
connect_bd_net [get_bd_pins xup_xor2_1/y] [get_bd_pins xup_xor2_2/b]
connect_bd_net [get_bd_pins xup_and2_0/y] [get_bd_pins xup_or2_0/a]
connect_bd_net [get_bd_pins xup_and2_1/y] [get_bd_pins xup_or2_0/b]
connect_bd_net [get_bd_pins a] [get_bd_pins xup_xor2_1/a] [get_bd_pins xup_and2_1/a] [get_bd_pins xup_xor2_0/a]
connect_bd_net [get_bd_pins b] [get_bd_pins xup_xor2_1/b] [get_bd_pins xup_and2_1/b] [get_bd_pins xup_xor2_0/b]
connect_bd_net [get_bd_pins Cin] [get_bd_pins xup_and2_0/b] [get_bd_pins xup_xor2_2/a]
connect_bd_net [get_bd_pins xup_xor2_2/y] [get_bd_pins X]
connect_bd_net [get_bd_pins xup_or2_0/y] [get_bd_pins Cout]

current_bd_instance /S3_Mux/Score/Score_Adder/Three_Bit
connect_bd_net [get_bd_pins xup_xor2_0/y] [get_bd_pins xup_and2_0/a]
connect_bd_net [get_bd_pins xup_xor2_1/y] [get_bd_pins xup_xor2_2/b]
connect_bd_net [get_bd_pins xup_and2_0/y] [get_bd_pins xup_or2_0/a]
connect_bd_net [get_bd_pins xup_and2_1/y] [get_bd_pins xup_or2_0/b]
connect_bd_net [get_bd_pins a] [get_bd_pins xup_xor2_1/a] [get_bd_pins xup_and2_1/a] [get_bd_pins xup_xor2_0/a]
connect_bd_net [get_bd_pins b] [get_bd_pins xup_xor2_1/b] [get_bd_pins xup_and2_1/b] [get_bd_pins xup_xor2_0/b]
connect_bd_net [get_bd_pins Cin] [get_bd_pins xup_and2_0/b] [get_bd_pins xup_xor2_2/a]
connect_bd_net [get_bd_pins xup_xor2_2/y] [get_bd_pins X]
connect_bd_net [get_bd_pins xup_or2_0/y] [get_bd_pins Cout]

current_bd_instance /S3_Mux/Score/Score_Adder/Zero_Bit
connect_bd_net [get_bd_pins xup_xor2_0/y] [get_bd_pins xup_and2_0/a]
connect_bd_net [get_bd_pins xup_xor2_1/y] [get_bd_pins xup_xor2_2/b]
connect_bd_net [get_bd_pins xup_and2_0/y] [get_bd_pins xup_or2_0/a]
connect_bd_net [get_bd_pins xup_and2_1/y] [get_bd_pins xup_or2_0/b]
connect_bd_net [get_bd_pins a] [get_bd_pins xup_xor2_1/a] [get_bd_pins xup_and2_1/a] [get_bd_pins xup_xor2_0/a]
connect_bd_net [get_bd_pins b] [get_bd_pins xup_xor2_1/b] [get_bd_pins xup_and2_1/b] [get_bd_pins xup_xor2_0/b]
connect_bd_net [get_bd_pins Cin] [get_bd_pins xup_and2_0/b] [get_bd_pins xup_xor2_2/a]
connect_bd_net [get_bd_pins xup_xor2_2/y] [get_bd_pins X]
connect_bd_net [get_bd_pins xup_or2_0/y] [get_bd_pins Cout]

current_bd_instance /S3_Mux/Score/Score_Adder/Two_Bit
connect_bd_net [get_bd_pins xup_xor2_0/y] [get_bd_pins xup_and2_0/a]
connect_bd_net [get_bd_pins xup_xor2_1/y] [get_bd_pins xup_xor2_2/b]
connect_bd_net [get_bd_pins xup_and2_0/y] [get_bd_pins xup_or2_0/a]
connect_bd_net [get_bd_pins xup_and2_1/y] [get_bd_pins xup_or2_0/b]
connect_bd_net [get_bd_pins a] [get_bd_pins xup_xor2_1/a] [get_bd_pins xup_and2_1/a] [get_bd_pins xup_xor2_0/a]
connect_bd_net [get_bd_pins b] [get_bd_pins xup_xor2_1/b] [get_bd_pins xup_and2_1/b] [get_bd_pins xup_xor2_0/b]
connect_bd_net [get_bd_pins Cin] [get_bd_pins xup_and2_0/b] [get_bd_pins xup_xor2_2/a]
connect_bd_net [get_bd_pins xup_xor2_2/y] [get_bd_pins X]
connect_bd_net [get_bd_pins xup_or2_0/y] [get_bd_pins Cout]

current_bd_instance /S3_Mux/Score/Score_Grabber
connect_bd_net [get_bd_pins xlslice_0/Dout] [get_bd_pins xup_dff_en_reset_0/d]
connect_bd_net [get_bd_pins xlslice_1/Dout] [get_bd_pins xup_dff_en_reset_1/d]
connect_bd_net [get_bd_pins xlslice_2/Dout] [get_bd_pins xup_dff_en_reset_2/d]
connect_bd_net [get_bd_pins xlslice_3/Dout] [get_bd_pins xup_dff_en_reset_3/d]
connect_bd_net [get_bd_pins xup_inv_0/y] \
  [get_bd_pins xup_dff_en_reset_1/clk] [get_bd_pins xup_dff_en_reset_2/clk] [get_bd_pins xup_dff_en_reset_3/clk] \
  [get_bd_pins xup_dff_en_reset_0/clk]
connect_bd_net [get_bd_pins ENABLE/dout] \
  [get_bd_pins xup_dff_en_reset_1/en] [get_bd_pins xup_dff_en_reset_2/en] [get_bd_pins xup_dff_en_reset_3/en] \
  [get_bd_pins xup_dff_en_reset_0/en]
connect_bd_net [get_bd_pins RESET] \
  [get_bd_pins xup_dff_en_reset_1/reset] [get_bd_pins xup_dff_en_reset_2/reset] [get_bd_pins xup_dff_en_reset_3/reset] \
  [get_bd_pins xup_dff_en_reset_0/reset]
connect_bd_net [get_bd_pins xup_dff_en_reset_0/q] [get_bd_pins BIT_0]
connect_bd_net [get_bd_pins VAL] [get_bd_pins xlslice_1/Din] [get_bd_pins xlslice_2/Din] [get_bd_pins xlslice_3/Din] [get_bd_pins xlslice_0/Din]
connect_bd_net [get_bd_pins xup_dff_en_reset_1/q] [get_bd_pins BIT_1]
connect_bd_net [get_bd_pins xup_dff_en_reset_2/q] [get_bd_pins BIT_2]
connect_bd_net [get_bd_pins xup_dff_en_reset_3/q] [get_bd_pins BIT_3]
connect_bd_net [get_bd_pins CLK] [get_bd_pins xup_inv_0/a]

current_bd_instance /S3_Mux/Enable_Mux
connect_bd_net [get_bd_pins xlconstant_1/dout] \
  [get_bd_pins xup_4_to_1_mux_vector_0/a] [get_bd_pins xup_4_to_1_mux_vector_0/b] [get_bd_pins xup_4_to_1_mux_vector_0/c] \
  [get_bd_pins xup_4_to_1_mux_vector_1/a] [get_bd_pins xup_4_to_1_mux_vector_1/b] [get_bd_pins xup_4_to_1_mux_vector_1/d] \
  [get_bd_pins xup_4_to_1_mux_vector_2/a] [get_bd_pins xup_4_to_1_mux_vector_2/c] [get_bd_pins xup_4_to_1_mux_vector_2/d] \
  [get_bd_pins xup_4_to_1_mux_vector_3/b] [get_bd_pins xup_4_to_1_mux_vector_3/c] [get_bd_pins xup_4_to_1_mux_vector_3/d]
connect_bd_net [get_bd_pins xlconstant_0/dout] \
  [get_bd_pins xup_4_to_1_mux_vector_0/d] [get_bd_pins xup_4_to_1_mux_vector_1/c] [get_bd_pins xup_4_to_1_mux_vector_2/b] \
  [get_bd_pins xup_4_to_1_mux_vector_3/a]
connect_bd_net [get_bd_pins sel_0] \
  [get_bd_pins xup_4_to_1_mux_vector_0/sel] [get_bd_pins xup_4_to_1_mux_vector_2/sel] \
  [get_bd_pins xup_4_to_1_mux_vector_3/sel] [get_bd_pins xup_4_to_1_mux_vector_1/sel]
connect_bd_net [get_bd_pins xup_4_to_1_mux_vector_1/y] [get_bd_pins AN1]
connect_bd_net [get_bd_pins xup_4_to_1_mux_vector_2/y] [get_bd_pins AN2]
connect_bd_net [get_bd_pins xup_4_to_1_mux_vector_3/y] [get_bd_pins AN3]
connect_bd_net [get_bd_pins xup_4_to_1_mux_vector_0/y] [get_bd_pins AN0]

current_bd_instance /S3_Mux/CLK_DIV_1kHz
connect_bd_net -net xup_clk_divider_6_clkout1 [get_bd_pins xup_clk_divider_14/clkout] [get_bd_pins xup_clk_divider_15/clkin]
connect_bd_net [get_bd_pins xup_clk_divider_15/clkout] [get_bd_pins xup_clk_divider_16/clkin]
connect_bd_net [get_bd_pins xup_clk_divider_1/clkout] [get_bd_pins xup_clk_divider_2/clkin]
connect_bd_net [get_bd_pins xup_clk_divider_2/clkout] [get_bd_pins xup_clk_divider_3/clkin]
connect_bd_net [get_bd_pins xup_clk_divider_3/clkout] [get_bd_pins xup_clk_divider_4/clkin]
connect_bd_net [get_bd_pins xup_clk_divider_4/clkout] [get_bd_pins xup_clk_divider_5/clkin]
connect_bd_net [get_bd_pins xup_clk_divider_5/clkout] [get_bd_pins xup_clk_divider_6/clkin]
connect_bd_net [get_bd_pins xup_clk_divider_6/clkout] [get_bd_pins xup_clk_divider_7/clkin]
connect_bd_net [get_bd_pins xup_clk_divider_7/clkout] [get_bd_pins xup_clk_divider_8/clkin]
connect_bd_net -net xup_clk_divider_0_clkout1 [get_bd_pins xup_clk_divider_8/clkout] [get_bd_pins xup_clk_divider_9/clkin]
connect_bd_net -net xup_clk_divider_1_clkout1 [get_bd_pins xup_clk_divider_9/clkout] [get_bd_pins xup_clk_divider_10/clkin]
connect_bd_net -net xup_clk_divider_2_clkout1 [get_bd_pins xup_clk_divider_10/clkout] [get_bd_pins xup_clk_divider_11/clkin]
connect_bd_net -net xup_clk_divider_3_clkout1 [get_bd_pins xup_clk_divider_11/clkout] [get_bd_pins xup_clk_divider_12/clkin]
connect_bd_net -net xup_clk_divider_4_clkout1 [get_bd_pins xup_clk_divider_12/clkout] [get_bd_pins xup_clk_divider_13/clkin]
connect_bd_net -net xup_clk_divider_5_clkout1 [get_bd_pins xup_clk_divider_13/clkout] [get_bd_pins xup_clk_divider_14/clkin]
connect_bd_net [get_bd_pins xup_clk_divider_0/clkout] [get_bd_pins xup_clk_divider_1/clkin]
connect_bd_net [get_bd_pins xup_clk_divider_16/clkout] [get_bd_pins clkout]
connect_bd_net [get_bd_pins clk] [get_bd_pins xup_clk_divider_0/clkin]

current_bd_instance /S3_Mux/Segment_Decoder_V_L
connect_bd_net [get_bd_pins xup_inv_1/y] \
  [get_bd_pins ZERO/b] [get_bd_pins ONE/b] [get_bd_pins FOUR/b] [get_bd_pins FIVE/b] [get_bd_pins EIGHT/b] \
  [get_bd_pins NINE/b]
connect_bd_net [get_bd_pins xup_inv_2/y] \
  [get_bd_pins ZERO/c] [get_bd_pins ONE/c] [get_bd_pins TWO/c] [get_bd_pins THREE/c] [get_bd_pins EIGHT/c] \
  [get_bd_pins NINE/c]
connect_bd_net [get_bd_pins xup_inv_3/y] \
  [get_bd_pins ZERO/d] [get_bd_pins ONE/d] [get_bd_pins TWO/d] [get_bd_pins THREE/d] [get_bd_pins FOUR/d] \
  [get_bd_pins FIVE/d] [get_bd_pins SIX/d] [get_bd_pins SEVEN/d]
connect_bd_net [get_bd_pins ONE/y] \
  [get_bd_pins Segment_A/a] [get_bd_pins Segment_D/a] [get_bd_pins Segment_E/a] [get_bd_pins Segment_F/a] \
  [get_bd_pins Segment_G/b]
connect_bd_net [get_bd_pins ZERO/y] [get_bd_pins Segment_G/a]
connect_bd_net [get_bd_pins SEVEN/y] [get_bd_pins Segment_D/c] [get_bd_pins Segment_E/e] [get_bd_pins Segment_F/d] [get_bd_pins Segment_G/c]
connect_bd_net [get_bd_pins FOURTEEN/y] [get_bd_pins Segment_A/c] [get_bd_pins Segment_B/c] [get_bd_pins Segment_C/b] [get_bd_pins Segment_G/d]
connect_bd_net [get_bd_pins FIFTEEN/y] [get_bd_pins Segment_A/d] [get_bd_pins Segment_G/e]
connect_bd_net [get_bd_pins xup_inv_0/y] \
  [get_bd_pins ZERO/a] [get_bd_pins TWO/a] [get_bd_pins FOUR/a] [get_bd_pins SIX/a] [get_bd_pins EIGHT/a] \
  [get_bd_pins FOURTEEN/a]
connect_bd_net [get_bd_pins FOUR/y] [get_bd_pins Segment_A/b] [get_bd_pins Segment_D/b] [get_bd_pins Segment_E/c]
connect_bd_net [get_bd_pins TWO/y] [get_bd_pins Segment_C/a] [get_bd_pins Segment_F/b]
connect_bd_net [get_bd_pins FIVE/y] [get_bd_pins Segment_B/a] [get_bd_pins Segment_E/d]
connect_bd_net [get_bd_pins SIX/y] [get_bd_pins Segment_B/b]
connect_bd_net [get_bd_pins THREE/y] [get_bd_pins Segment_E/b] [get_bd_pins Segment_F/c]
connect_bd_net [get_bd_pins NINE/y] [get_bd_pins Segment_E/f]
connect_bd_net -net X0_1 [get_bd_pins X0] \
  [get_bd_pins xup_inv_0/a] [get_bd_pins THREE/a] [get_bd_pins FIVE/a] [get_bd_pins SEVEN/a] [get_bd_pins NINE/a] \
  [get_bd_pins FIFTEEN/a] [get_bd_pins ONE/a]
connect_bd_net -net xup_or3_1_y [get_bd_pins Segment_G/y] [get_bd_pins G]
connect_bd_net -net X2_1 [get_bd_pins X2] \
  [get_bd_pins xup_inv_2/a] [get_bd_pins FIVE/c] [get_bd_pins SIX/c] [get_bd_pins SEVEN/c] [get_bd_pins FOURTEEN/c] \
  [get_bd_pins FIFTEEN/c] [get_bd_pins FOUR/c]
connect_bd_net -net X1_1 [get_bd_pins X1] \
  [get_bd_pins xup_inv_1/a] [get_bd_pins TWO/b] [get_bd_pins THREE/b] [get_bd_pins SIX/b] [get_bd_pins SEVEN/b] \
  [get_bd_pins FIFTEEN/b] [get_bd_pins FOURTEEN/b]
connect_bd_net -net X3_1 [get_bd_pins X3] \
  [get_bd_pins xup_inv_3/a] [get_bd_pins EIGHT/d] [get_bd_pins NINE/d] [get_bd_pins FIFTEEN/d] [get_bd_pins FOURTEEN/d]
connect_bd_net -net xup_or2_0_y [get_bd_pins Segment_B/y] [get_bd_pins B]
connect_bd_net -net xup_or3_0_y [get_bd_pins Segment_A/y] [get_bd_pins A]
connect_bd_net -net xup_or3_0_y1 [get_bd_pins Segment_D/y] [get_bd_pins D]
connect_bd_net -net xup_or3_0_y3 [get_bd_pins Segment_F/y] [get_bd_pins F]
connect_bd_net -net xup_or3_0_y2 [get_bd_pins Segment_E/y] [get_bd_pins E]
connect_bd_net -net xup_or2_0_y1 [get_bd_pins Segment_C/y] [get_bd_pins C]

current_bd_instance /
connect_bd_net [get_bd_ports L_Val] [get_bd_pins S3_Mux/L_Val]
connect_bd_net [get_bd_ports C_Val] [get_bd_pins S3_Mux/C_Val]
connect_bd_net [get_bd_ports R_Val] [get_bd_pins S3_Mux/R_Val]
connect_bd_net -net Enable_Mux_AN0 [get_bd_pins S3_Mux/AN0] [get_bd_ports AN0]
connect_bd_net -net Enable_Mux_AN1 [get_bd_pins S3_Mux/AN1] [get_bd_ports AN1]
connect_bd_net -net Enable_Mux_AN2 [get_bd_pins S3_Mux/AN2] [get_bd_ports AN2]
connect_bd_net -net Enable_Mux_AN3 [get_bd_pins S3_Mux/AN3] [get_bd_ports AN3]
connect_bd_net -net Segment_Decoder_V_L_A [get_bd_pins S3_Mux/A] [get_bd_ports A]
connect_bd_net -net Segment_Decoder_V_L_B [get_bd_pins S3_Mux/B] [get_bd_ports B]
connect_bd_net -net Segment_Decoder_V_L_C [get_bd_pins S3_Mux/C] [get_bd_ports C]
connect_bd_net -net Segment_Decoder_V_L_D [get_bd_pins S3_Mux/D] [get_bd_ports D]
connect_bd_net -net Segment_Decoder_V_L_E [get_bd_pins S3_Mux/E] [get_bd_ports E]
connect_bd_net -net Segment_Decoder_V_L_F [get_bd_pins S3_Mux/F] [get_bd_ports F]
connect_bd_net -net Segment_Decoder_V_L_G [get_bd_pins S3_Mux/G] [get_bd_ports G]
connect_bd_net [get_bd_ports Reel_clk] [get_bd_pins S3_Mux/Reel_clk]
connect_bd_net [get_bd_ports RESET] [get_bd_pins S3_Mux/RESET]
connect_bd_net [get_bd_ports Double] [get_bd_pins S3_Mux/Double]
connect_bd_net [get_bd_ports Triple] [get_bd_pins S3_Mux/Triple]
connect_bd_net [get_bd_ports clk] [get_bd_pins S3_Mux/clk]

validate_bd_design
save_bd_design
